# Altium schematic sheet Electronic_load_REVA.SchDoc: Electronic load 200W
size A4; DrawnBy: Matas R.; Engineer: Matas R.; Revision: REV A
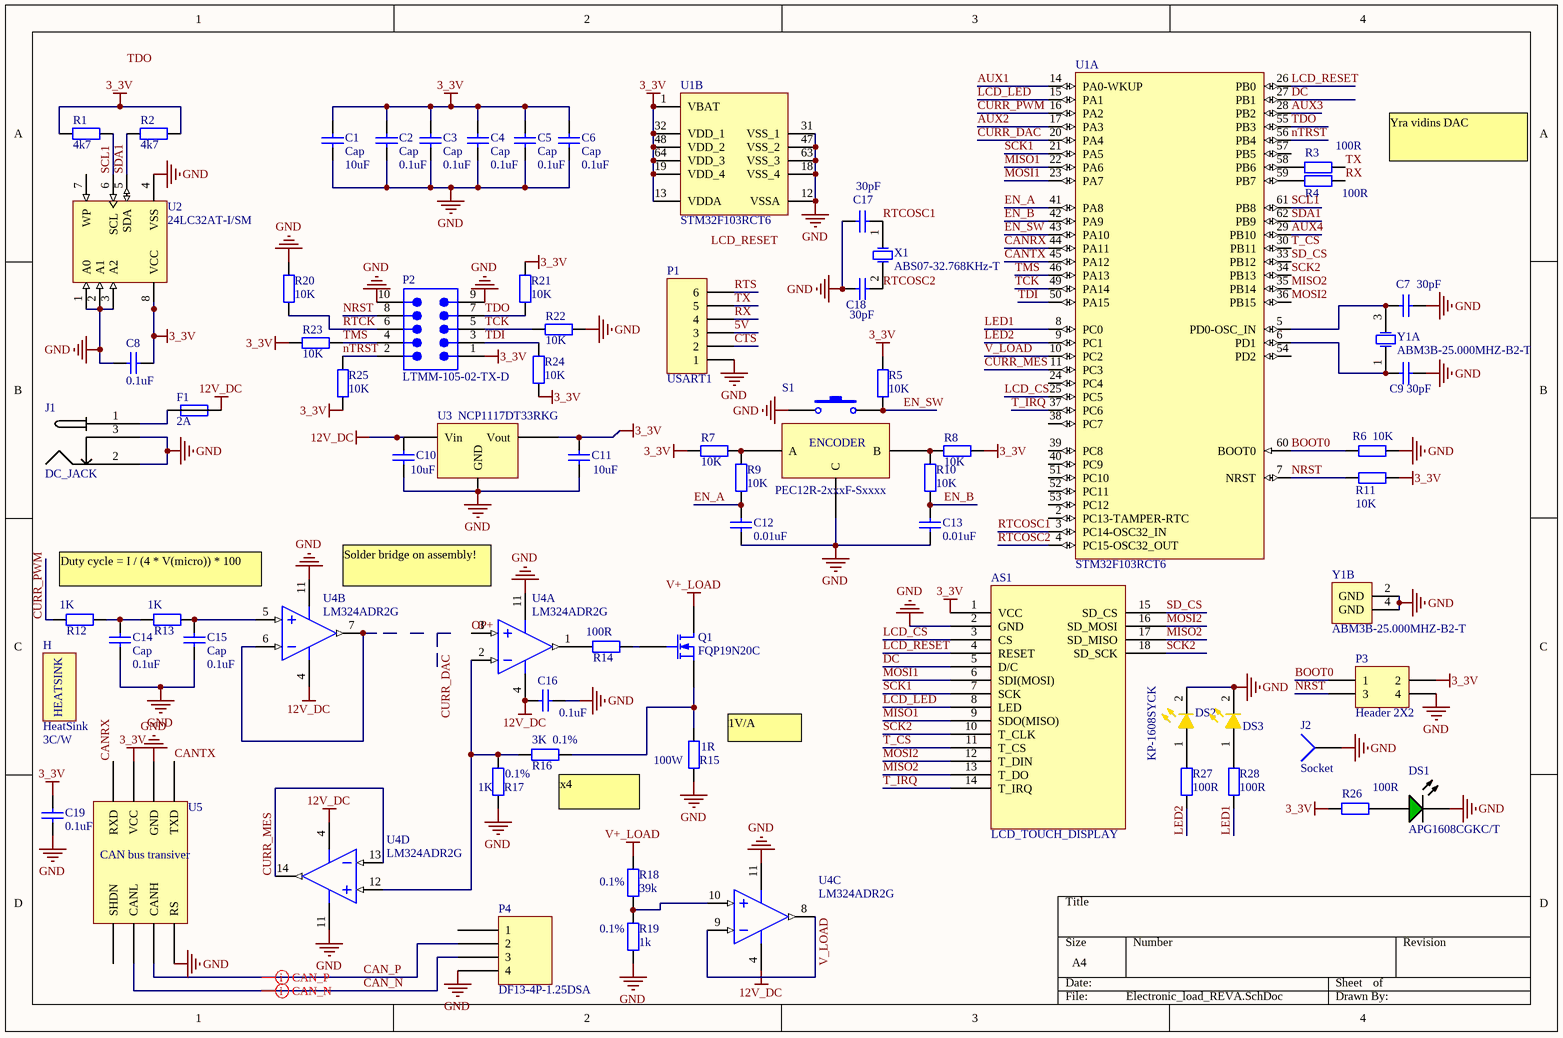
[diagram p0: Electronic_load_REVA.SchDoc]

## Parts
AS1  LCD_TOUCH_DISPLAY  [LCD_SPI]
C1  Cap  value 10uF  [1206_CAP]
C2  Cap  value 0.1uF  [0603_CAP]
C3  Cap  value 0.1uF  [0603_CAP]
C4  Cap  value 0.1uF  [0603_CAP]
C5  Cap  value 0.1uF  [0603_CAP]
C6  Cap  value 0.1uF  [0603_CAP]
C7  value 30pF  [0603_CAP]  (hidden comment: Cap)
C8  value 0.1uF  [0603_CAP]  (hidden comment: Cap)
C9  value 30pF  [0603_CAP]  (hidden comment: Cap)
C10  value 10uF  [1206_CAP]  (hidden comment: Cap)
C11  value 10uF  [1206_CAP]  (hidden comment: Cap)
C12  value 0.01uF  [0603_CAP]  (hidden comment: ap)
C13  value 0.01uF  [0603_CAP]  (hidden comment: ap)
C14  Cap  value 0.1uF  [0603_CAP]
C15  Cap  value 0.1uF  [0603_CAP]
C16  value 0.1uF  [0603_CAP]  (hidden comment: Cap)
C17  value 30pF  [0603_CAP]  (hidden comment: Cap)
C18  value 30pF  [0603_CAP]  (hidden comment: Cap)
C19  value 0.1uF  [0603_CAP]  (hidden comment: Cap)
DS1  APG1608CGKC/T  [KING-LED0603-25-GREEN_V]
DS2  KP-1608SYCK  [KING-0603LED_YELLOW_V]
DS3  KP-1608SYCK  [KING-0603LED_YELLOW_V]  (value not drawn)
F1  Current: 2A  [0603_RES]  (hidden comment: Fuse)
H  HeatSink  [Heat_Sink]
J1  DC_JACK  [DC_JACK_6.3mm]
J2  Socket  [PIN1]
P1  USART1  [HDR1X6]
P2  LTMM-105-02-TX-D  [SMTC-LTMM-105-02-XX-D]
P3  Header 2X2  [HDR2X2]
P4  DF13-4P-1.25DSA  [DF13-4P-1.25DSA]
Q1  FQP19N20C  [TO220V]
R1  value 4k7  [0603_RES]  (hidden comment: Res)
R2  value 4k7  [0603_RES]  (hidden comment: Res)
R3  value 100R  [0603_RES]  (hidden comment: Res)
R4  value 100R  [0603_RES]  (hidden comment: Res)
R5  value 10K  [0603_RES]  (hidden comment: Res)
R6  value 10K  [0603_RES]  (hidden comment: Res)
R7  value 10K  [0603_RES]  (hidden comment: Res)
R8  value 10K  [0603_RES]  (hidden comment: Res)
R9  value 10K  [0603_RES]  (hidden comment: Res)
R10  value 10K  [0603_RES]  (hidden comment: Res)
R11  value 10K  [0603_RES]  (hidden comment: Res)
R12  value 1K  [0603_RES]  (hidden comment: Res)
R13  value 1K  [0603_RES]  (hidden comment: Res)
R14  value 100R  [0603_RES]  (hidden comment: Res)
R15  value 1R  Power: 100W  [100W_res]  (hidden comment: Res)
R16  value 3K  Tolerance: 0.1%  [0603_RES]  (hidden comment: Res)
R17  value 1K  Tolerance: 0.1%  [0603_RES]  (hidden comment: Res)
R18  value 39k  Tolerance: 0.1%  [0603_RES]  (hidden comment: Res)
R19  value 1k  Tolerance: 0.1%  [0603_RES]  (hidden comment: Res)
R20  value 10K  [0603_RES]  (hidden comment: Res)
R21  value 10K  [0603_RES]  (hidden comment: Res)
R22  value 10K  [0603_RES]  (hidden comment: Res)
R23  value 10K  [0603_RES]  (hidden comment: Res)
R24  value 10K  [0603_RES]  (hidden comment: Res)
R25  value 10K  [0603_RES]  (hidden comment: Res)
R26  value 100R  [0603_RES]  (hidden comment: Res)
R27  value 100R  [0603_RES]  (hidden comment: Res)
R28  value 100R  [0603_RES]  (hidden comment: Res)
S1  PEC12R-2xxxF-Sxxxx  [Rotary_encoder_ver]
U1  STM32F103RCT6  [LQFP64_N]  (parts A,B of 2)
U2  24LC32AT-I/SM  [SOIJ-SM8_L]
U3  NCP1117DT33RKG  [TO-252]
U4  LM324ADR2G  [ONSC-SOIC-14-751A-03_V]  (parts A,B,C,D of 4)
U5  CAN bus transiver  [SOIC127P600X175-8M]
X1  ABS07-32.768KHz-T  [ABRA-ABS07-2_V]
Y1  ABM3B-25.000MHZ-B2-T  [ABRA-ABM3B-4_V]  (parts A,B of 2)

## Nets
3_3V: AS1.1(VCC) C1.1 C2.1 C3.1 C4.1 C5.1 C6.1 C8.2 C11.1 C19.2 P2.1 P3.2 R1.1 R2.2 R5.2 R7.2 R8.1 R11.2 R21.2 R23.1 R24.1 R25.1 R26.2 U1.1(VBAT) U1.13(VDDA) U1.19(VDD_4) U1.32(VDD_1) U1.48(VDD_2) U1.64(VDD_3) U2.8(VCC) U3.Vout U5.3(VCC)
12V_DC: C10.1 C16.1 F1.2 U3.Vin U4.4(VCC)
GND: AS1.2(GND) C1.2 C2.2 C3.2 C4.2 C5.2 C6.2 C7.2 C8.1 C9.2 C10.2 C11.2 C12.1 C13.1 C14.1 C15.1 C16.2 C17.1 C18.1 C19.1 DS1.2(K) DS2.2(K) DS3.2(K) J1.2 J1.3 J2.1 P1.1 P2.9 P2.10 P3.4 P4.4 R6.2 R15.1 R17.1 R19.2 R20.1 R22.1 S1.1 S1.C U1.12(VSSA) U1.18(VSS_4) U1.31(VSS_1) U1.47(VSS_2) U1.63(VSS_3) U2.1(A0) U2.2(A1) U2.3(A2) U2.4(VSS) U3.GN(GND) U4.11(VEE/GND) U5.2(GND) U5.8(RS) Y1.2(GND) Y1.4(GND)
V+_LOAD: Q1.D R18.1
5V: P1.3
AUX1: U1.14(PA0-WKUP)
AUX2: U1.17(PA3)
AUX3: U1.28(PB2)
AUX4: U1.29(PB10)
BOOT0: P3.1 R6.1 U1.60(BOOT0)
CAN_N: P4.3 U5.6(CANL)
CAN_P: P4.2 U5.7(CANH)
CANRX: U1.44(PA11) U5.4(RXD)
CANTX: U1.45(PA12) U5.1(TXD)
CTS: P1.2
CURR_DAC: U1.20(PA4)
CURR_MES: U1.11(PC3) U4.13(IN4-) U4.14(OUT4)
CURR_PWM: R12.1 U1.16(PA2)
DC: AS1.5(D/C) U1.27(PB1)
EN_A: C12.2 R9.2 U1.41(PA8)
EN_B: C13.2 R10.2 U1.42(PA9)
EN_SW: R5.1 S1.2 U1.43(PA10)
LCD_CS: AS1.3(CS) U1.25(PC5)
LCD_LED: AS1.8(LED) U1.15(PA1)
LCD_RESET: AS1.4(RESET) U1.26(PB0)
LED1: R28.2 U1.8(PC0)
LED2: R27.2 U1.9(PC1)
MISO1: AS1.9(SDO(MISO)) U1.22(PA6)
MISO2: AS1.13(T_DO) AS1.17(SD_MISO) U1.35(PB14)
MOSI1: AS1.6(SDI(MOSI)) U1.23(PA7)
MOSI2: AS1.12(T_DIN) AS1.16(SD_MOSI) U1.36(PB15)
NRST: P2.8 P3.3 R11.1 U1.7(NRST)
nTRST: P2.2 R25.2 U1.56(PB4)
OP+: U4.3(IN1+)
RTCK: P2.6 R20.2
RTCOSC1: C17.2 U1.3(PC14-OSC32_IN) X1.1(X1)
RTCOSC2: C18.2 U1.4(PC15-OSC32_OUT) X1.2(X2)
RTS: P1.6
RX: P1.4 R4.1
SCK1: AS1.7(SCK) U1.21(PA5)
SCK2: AS1.10(T_CLK) AS1.18(SD_SCK) U1.34(PB13)
SCL1: R1.2 U1.61(PB8) U2.6(SCL)
SD_CS: AS1.15(SD_CS) U1.33(PB12)
SDA1: R2.1 U1.62(PB9) U2.5(SDA)
T_CS: AS1.11(T_CS) U1.30(PB11)
T_IRQ: AS1.14(T_IRQ) U1.37(PC6)
TCK: P2.5 R22.2 U1.49(PA14)
TDI: P2.3 R24.2 U1.50(PA15)
TDO: P2.7 R21.1 U1.55(PB3)
TMS: P2.4 R23.2 U1.46(PA13)
TX: P1.5 R3.1
V_LOAD: U1.10(PC2) U4.8(OUT3) U4.9(IN3-)
NetC7_1: C7.1 U1.5(PD0-OSC_IN) Y1.3(X2)
NetC9_1: C9.1 U1.6(PD1) Y1.1(X1)
NetC14_2: C14.2 R12.2 R13.1
NetC15_2: C15.2 R13.2 U4.5(IN2+)
NetDS1_1: DS1.1(A) R26.1
NetDS2_1: DS2.1(A) R27.1
NetDS3_1: DS3.1(A) R28.1
NetF1_1: F1.1 J1.1
NetQ1_G: Q1.G R14.2
NetQ1_S: Q1.S R15.2 R16.1
NetR3_2: R3.2 U1.58(PB6)
NetR4_2: R4.2 U1.59(PB7)
NetR7_1: R7.1 R9.1 S1.A
NetR8_2: R8.2 R10.1 S1.B
NetR14_1: R14.1 U4.1(OUT1)
NetR16_2: R16.2 R17.2 U4.2(IN1-) U4.12(IN4+)
NetR18_2: R18.2 R19.1 U4.10(IN3+)
NetU4_6: U4.6(IN2-) U4.7(OUT2)

Not connected (* = marked no-connect by the designer): P4 1; U1 2(PC13-TAMPER-RTC) 24(PC4) 38(PC7) 39(PC8) 40(PC9) 51(PC10) 52(PC11) 53(PC12) 54(PD2) 57(PB5); U2 7(WP); U5 5(SHDN)

## Layout directives
differential pair: CAN_N, CAN_P

## Notes on the sheet
- Yra vidins DAC
- Duty cycle = I / (4 * V(micro)) * 100
- (near U4) Solder bridge on assembly!
- (near R15) 1V/A
- (near R16) x4
- Labels drawn without touching a wire or pin: LCD_RESET, TDO
- (in symbol HeatSink) HEATSINK; 3C/W
- (in symbol PEC12R-2xxxF-Sxxxx) ENCODER

## Library data of the parts
AS1 = LCD_SPI: http://www.ebay.co.uk/itm/240x320-2-4-SPI-TFT-LCD-Touch-Panel-Serial-Port-Module-with-PBC-ILI9341-5V-3-3V-/121414443081?pt=UK_BOI_Electrical_Components_Supplies_ET&hash=item1c44dd6049
C1-C18 = Cap: Capacitor; Published: 8-Jun-2000; LatestRevisionDate: 17-Jul-2002; LatestRevisionNote: Re-released for DXP Platform.; PackageReference: RAD-0.3; Publisher: Altium Limited; PackageDescription: Radial Cap, Thru-Hole; 2 Leads; 0.3 in Pin Spacing
DS1 = CMP-0239-00001-1: LED, SMT, 0603(1608), 0.25mm Thickness, Green; Forward Current: 30 mA; Reverse Voltage: 5 V; Power Dissipation: 78 mW; Packing: Reel; ComponentLink1Description: Manufacturer URL; ComponentLink1URL: http://www.kingbrightusa.com/; ComponentLink2URL: http://www.kingbrightusa.com/images/catalog/SPEC/APG1608CGKC-T.pdf; Mounting Technology: Surface Mount; Storage Temperature: -40 to 85 degC; DatasheetVersion: Rev. 5B, 10/2012; PartNumber: APG1608CGKC/T; PackageReference: LED0603-25-GREEN; ComponentLink2Description: Datasheet; PackageDescription: 2-Pin SMT LED, 1.6 x 0.8 mm Body, 0.25mm Thickness; PackageVersion: Rev. 5B, 10/2012
DS2 DS3 = CMP-0404-00003-1: LED, SMT, 0603(1608), 1.1mm thickness, Yellow; Manufacturer: Kingbright; Reverse Voltage: 5 V; Packing Type: 2000 pcs / reel; Forward Current: 30 mA; Power Dissipation: 75 mW; ComponentLink2URL: http://www.kingbright.com/manager/upload/pdf/(1366274739)KP-1608SYCK(Ver.18B).pdf; PartNumber: KP-1608SYCK; ComponentLink1URL: http://www.kingbright.com/; ComponentLink2Description: Datasheet; PackageDescription: 2-Pin SMT LED, 1.6 x 0.8 mm Pitch; PackageReference: 0603LED_YELLOW; ComponentLink1Description: Manufacturer URL; Storage Temperature: -40 to +85 degC; Mounting Technology: Surface Mount
F1 = Fuse: Umax: 32V; Type: Normal Blow
P1 = Header 6: Header, 6-Pin; LatestRevisionDate: 17-Jul-2002; LatestRevisionNote: Re-released for DXP Platform.; Publisher: Altium Limited
P2 = CMP-1028-00010-1: Shrouded Header & Stacker, Through-Hole, Vertical, -55 to 105 degC, 2 mm Pitch, 10-Pin, Male, RoHS; Manufacturer: Samtec; Pitch: 2 mm; RoHS: True; Temperature Range: -55 to 105 degC; PackageVersion: AQ, 5/1992; DatasheetVersion: F-214; ComponentLink1Description: Manufacturer URL; ComponentLink2Description: Datasheet; ComponentLink3Description: Package Specification; Mounting Technology: Through-hole; Orientation: Vertical; ComponentLink3URL: http://www.samtec.com/documents/webfiles/cpdf/LTMM-1XX-XX-XX-D-XX-XX-MKT.pdf; PackageReference: LTMM-105-02-XX-D; PackageDescription: LTMM Assembly; ComponentLink2URL: http://d2a072wq521u33.cloudfront.net/catalog_english//LTMM.PDF; PartNumber: LTMM-105-02-TX-D; ComponentLink1URL: http://www.samtec.com
P3 = Header 2X2: Header, 2-Pin, Dual row; LatestRevisionDate: 17-Jul-2002; LatestRevisionNote: Re-released for DXP Platform.; Publisher: Altium Limited
Q1 = MOSSFET N-Channel: N-channel MOSFET; R(ds): 100m; I(d): 10A; V(gs): 30V; V(ds): 200V; V(gs)min: V
R1-R14 R20-R28 = Res: Power: 0.125W; Tolerance: 1%; Part_number: *
R15 = Res: Part_number: Ebay; Tolerance: 5%
R16-R19 = Res: Power: 0.125W; Part_number: *
U1 = CMP-0237-00009-2: STM32 ARM-based 32-bit MCU Performance Line with 256 kB Flash, 48 kB Internal RAM, -40 to +85°C Temperature, 64-Pin LQFP, Tray; ComponentLink1URL: http://www.st.com/internet/com/TECHNICAL_RESOURCES/TECHNICAL_LITERATURE/DATASHEET/CD00191185.pdf; PackageDescription: 64-Pin Low-Profile Quad Flat Pack, 10 x 10 mm Body, 0.5 mm Pitch (LQFP64); ComponentLink3URL: http://www.st.com/internet/com/home/home.jsp; ComponentLink2Description: STM32 Family Web Page; ComponentLink2URL: www.st.com/stm32; PackageReference: LQFP64; DatasheetVersion: rev8.0, Apr-2011; RevisionNote: Package Corrected; PackageVersion: rev13, Apr-2011; ComponentLink3Description: st.com Home; ComponentLink1Description: STM32F103 Datasheet
U2 = CMP-0159-00548-1: 32Kbit, 400kHz, 2.5V, I2C Serial EEPROM, 8-Pin SOIC 208mil, Industrial Temperature, Tape and Reel; DatasheetVersion: revJ, Feb-2009; PackageVersion: revBB, Aug-2009; PackageDescription: 8-Lead Plastic Small Outline (SM) - Medium, 5.28 mm Body [SOIJ]; PackageReference: SOIJ-SM8
U3 = Linear: pin to pad: GN>1 Vin>3 Vout>4
U4 = CMP-1310-00169-1: Single Supply Quad Operational Amplifier, 3 to 32 V, 0 to 70 degC, 14-Pin SOIC, Pb-Free, Tape and Reel; Manufacturer: On Semiconductor; VCC Min (V): 3; VCC Max (V): 32; PackageReference: SOIC-14-751A-03; PackageVersion: Rev. K, 05/2011; ComponentLink2URL: http://www.onsemi.cn/pub_link/Collateral/LM324-D.PDF; Packing: Tape and Reel; ComponentLink1URL: http://www.onsemi.com/; PackageDescription: 14-Pin Small Outline Integrated Circuit, Body 8.65 x 3.9 mm, Pitch 1.27 mm; RoHS: TRUE; ComponentLink2Description: Datasheet; ComponentLink3URL: http://www.onsemi.com/pub_link/Collateral/751A-03.PDF; PartNumber: LM324ADR2G; Mounting Technology: Surface Mount; DatasheetVersion: Rev. 25; ComponentLink1Description: Manufacturer URL; ComponentLink3Description: Package Specification
U5 = MAX3051
X1 = CMP-0447-00001-2: Crystal, 32.768 kHz, 12.5 pF, -40 to 85 degC, SMD Low Profile 3.2 x 1.5 x 0.9 mm, Tape and Reel; Manufacturer: Abracon; Q Value (Type): 30000; Operation Mode: Flexural Mode (Tuning Fork); Shunt Capacitance (C0): 0.9 to 1.2 pF; Load Capacitance (CL): 12.5 pF; Frequency Tolerance @+25degC: +/- 20 ppm; Drive Level (Type): 0.1 uW; Equivalent Series Resistance (R1): 70 Kohm; Insulation Resistance (Min): 500 Mohm; ComponentLink3URL: http://www.abracon.com/Resonators/ABS07.pdf; PackageDescription: 2-Pin Hand Drawn, Body 3.2x1.5mm, Pitch 2.5mm; Operating Temperature: -40 to 85 degC; ComponentLink2URL: http://www.abracon.com/Resonators/ABS07.pdf; PackageReference: ABS07-2; ComponentLink3Description: Package Specification; ComponentLink1Description: Manufacturer URL; DatasheetVersion: 04.03.13; Mounting Technology: Surface Mount; ComponentLink2Description: Datasheet; ComponentLink1URL: http://www.abracon.com/; PartNumber: ABS07-32.768KHz-T; Packing: Tape and Reel; Frequency: 32.768 kHz
Y1 = CMP-0277-00001-1: Crystal, SMD, 25.000000MHz Stab=50ppm 18.0pF; Manufacturer: Abracon; Packing Type: Tape & Reel; Body Shape: Rectangular; Case Size: 5.0 x 3.2 mm; PackageDescription: 4-Pin SMT Crystal, 5.2 x 3.4 mm Body; ComponentLink2Description: Datasheet; Mounting Technology: Surface Mount; ComponentLink1URL: http://www.abracon.com/; PackageReference: ABM3B; DatasheetVersion: Apr-13; PartNumber: ABM3B-25.000MHZ-B2-T; ComponentLink2URL: http://www.abracon.com/Resonators/abm3b.pdf; ComponentLink1Description: Manufacturer URL; Storage Temperature: -40 to 80 degC
J2 = Socket: LatestRevisionDate: 17-Jul-2002; LatestRevisionNote: Re-released for DXP Platform.; Publisher: Altium Limited
P4 = DF13-4P-1.25DSA: Supplier 1: Mouser; Supplier Part Number 1: 798-DF13-4P-1.25DSA